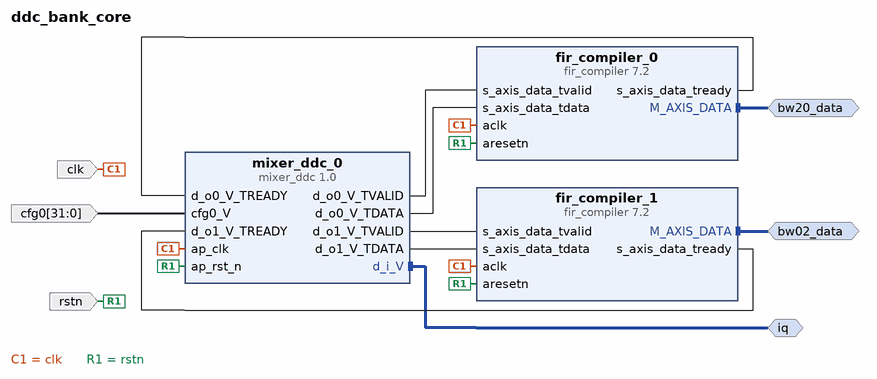
[diagram p0: block diagram of the top level]
# Vivado block design ddc_bank_core, xc7z045ffg900-2, Vivado 2017.4.1
create_bd_design ddc_bank_core

create_bd_intf_port -mode Master -vlnv xilinx.com:interface:axis_rtl:1.0 bw20_data
set_property -dict {CONFIG.FREQ_HZ 200000000} [get_bd_intf_ports bw20_data]
create_bd_intf_port -mode Master -vlnv xilinx.com:interface:acc_fifo_read_rtl:1.0 iq
create_bd_intf_port -mode Master -vlnv xilinx.com:interface:axis_rtl:1.0 bw02_data
set_property -dict {CONFIG.FREQ_HZ 200000000} [get_bd_intf_ports bw02_data]
create_bd_port -dir I -type clk clk
set_property -dict [list \
  CONFIG.FREQ_HZ 200000000 \
  CONFIG.ASSOCIATED_BUSIF iq:bw20_data:bw02_data \
  CONFIG.ASSOCIATED_RESET rstn \
] [get_bd_ports clk]
create_bd_port -dir I -type rst rstn
create_bd_port -dir I -from 31 -to 0 -type data cfg0
set_property -dict [list \
  CONFIG.LAYERED_METADATA {xilinx.com:interface:datatypes:1.0 {DATA {datatype {name {attribs {resolve_type immediate dependency {} format string minimum {} maximum {}} value {}} bitwidth {attribs {resolve_type immediate dependency {} format long minimum {} maximum {}} value 32} bitoffset {attribs {resolve_type immediate dependency {} format long minimum {} maximum {}} value 0} integer {signed {attribs {resolve_type immediate dependency {} format bool minimum {} maximum {}} value true}}}}}} \
] [get_bd_ports cfg0]

create_bd_cell -type ip -vlnv xilinx.com:ip:fir_compiler:7.2 fir_compiler_0
set_property -dict [list \
  CONFIG.CoefficientVector 235,-37,-181,-98,130,118,-169,-257,74,315,-2,-418,-181,429,371,-409,-637,256,899,12,-1183,-499,1424,1309,-1631,-2989,1754,10259,14579,10259,1754,-2989,-1631,1309,1424,-499,-1183,12,899,256,-637,-409,371,429,-181,-418,-2,315,74,-257,-169,118,130,-98,-181,-37,235 \
  CONFIG.Coefficient_Sets 1 \
  CONFIG.Coefficient_Reload false \
  CONFIG.Filter_Type Decimation \
  CONFIG.Interpolation_Rate 1 \
  CONFIG.Decimation_Rate 2 \
  CONFIG.Zero_Pack_Factor 1 \
  CONFIG.Number_Channels 1 \
  CONFIG.Number_Paths 4 \
  CONFIG.RateSpecification Input_Sample_Period \
  CONFIG.SamplePeriod 4 \
  CONFIG.Sample_Frequency 0.001 \
  CONFIG.Clock_Frequency 300.0 \
  CONFIG.Coefficient_Sign Signed \
  CONFIG.Quantization Integer_Coefficients \
  CONFIG.Coefficient_Width 16 \
  CONFIG.Coefficient_Fractional_Bits 0 \
  CONFIG.Coefficient_Structure Symmetric \
  CONFIG.Data_Width 16 \
  CONFIG.Output_Rounding_Mode Symmetric_Rounding_to_Infinity \
  CONFIG.Output_Width 19 \
  CONFIG.Filter_Architecture Systolic_Multiply_Accumulate \
  CONFIG.ColumnConfig 4 \
  CONFIG.M_DATA_Has_TREADY false \
  CONFIG.Has_ARESETn true \
] [get_bd_cells fir_compiler_0]
create_bd_cell -type ip -vlnv xilinx.com:ip:fir_compiler:7.2 fir_compiler_1
set_property -dict [list \
  CONFIG.CoefficientVector 67,41,48,51,50,43,29,10,-15,-43,-71,-97,-117,-127,-125,-109,-78,-33,23,86,150,208,252,276,274,243,179,87,-31,-164,-302,-432,-537,-602,-615,-562,-438,-237,36,375,766,1191,1628,2053,2443,2775,3027,3185,3239,3185,3027,2775,2443,2053,1628,1191,766,375,36,-237,-438,-562,-615,-602,-537,-432,-302,-164,-31,87,179,243,274,276,252,208,150,86,23,-33,-78,-109,-125,-127,-117,-97,-71,-43,-15,10,29,43,50,51,48,41,67 \
  CONFIG.Coefficient_Sets 1 \
  CONFIG.Coefficient_Reload false \
  CONFIG.Filter_Type Decimation \
  CONFIG.Interpolation_Rate 1 \
  CONFIG.Decimation_Rate 20 \
  CONFIG.Zero_Pack_Factor 1 \
  CONFIG.Number_Channels 1 \
  CONFIG.Number_Paths 4 \
  CONFIG.RateSpecification Input_Sample_Period \
  CONFIG.SamplePeriod 4 \
  CONFIG.Sample_Frequency 0.001 \
  CONFIG.Clock_Frequency 300.0 \
  CONFIG.Coefficient_Sign Signed \
  CONFIG.Quantization Integer_Coefficients \
  CONFIG.Coefficient_Width 16 \
  CONFIG.Coefficient_Fractional_Bits 0 \
  CONFIG.Coefficient_Structure Symmetric \
  CONFIG.Output_Rounding_Mode Symmetric_Rounding_to_Infinity \
  CONFIG.Output_Width 19 \
  CONFIG.Filter_Architecture Systolic_Multiply_Accumulate \
  CONFIG.ColumnConfig 1 \
  CONFIG.M_DATA_Has_TREADY false \
  CONFIG.Has_ARESETn true \
  CONFIG.Reset_Data_Vector true \
] [get_bd_cells fir_compiler_1]
create_bd_cell -type ip -vlnv xilinx.com:hls:mixer_ddc:1.0 mixer_ddc_0

# ---- connections ----

connect_bd_intf_net [get_bd_intf_ports bw20_data] [get_bd_intf_pins fir_compiler_0/M_AXIS_DATA]
connect_bd_intf_net [get_bd_intf_ports iq] [get_bd_intf_pins mixer_ddc_0/d_i_V]
connect_bd_intf_net [get_bd_intf_ports bw02_data] [get_bd_intf_pins fir_compiler_1/M_AXIS_DATA]
connect_bd_net -net ap_clk_1 [get_bd_ports clk] [get_bd_pins fir_compiler_0/aclk] [get_bd_pins fir_compiler_1/aclk] [get_bd_pins mixer_ddc_0/ap_clk]
connect_bd_net [get_bd_ports rstn] [get_bd_pins fir_compiler_0/aresetn] [get_bd_pins fir_compiler_1/aresetn] [get_bd_pins mixer_ddc_0/ap_rst_n]
connect_bd_net [get_bd_pins mixer_ddc_0/d_o0_V_TVALID] [get_bd_pins fir_compiler_0/s_axis_data_tvalid]
connect_bd_net [get_bd_pins fir_compiler_0/s_axis_data_tready] [get_bd_pins mixer_ddc_0/d_o0_V_TREADY]
connect_bd_net [get_bd_pins fir_compiler_1/s_axis_data_tready] [get_bd_pins mixer_ddc_0/d_o1_V_TREADY]
connect_bd_net [get_bd_pins mixer_ddc_0/d_o1_V_TVALID] [get_bd_pins fir_compiler_1/s_axis_data_tvalid]
connect_bd_net -net cfg0_1 [get_bd_ports cfg0] [get_bd_pins mixer_ddc_0/cfg0_V]
connect_bd_net [get_bd_pins mixer_ddc_0/d_o1_V_TDATA] [get_bd_pins fir_compiler_1/s_axis_data_tdata]
connect_bd_net [get_bd_pins mixer_ddc_0/d_o0_V_TDATA] [get_bd_pins fir_compiler_0/s_axis_data_tdata]

validate_bd_design
save_bd_design
